# Altium schematic sheet 2.4Ghz Chip Board.SchDoc: 2.4Ghz Chip Board
size Letter
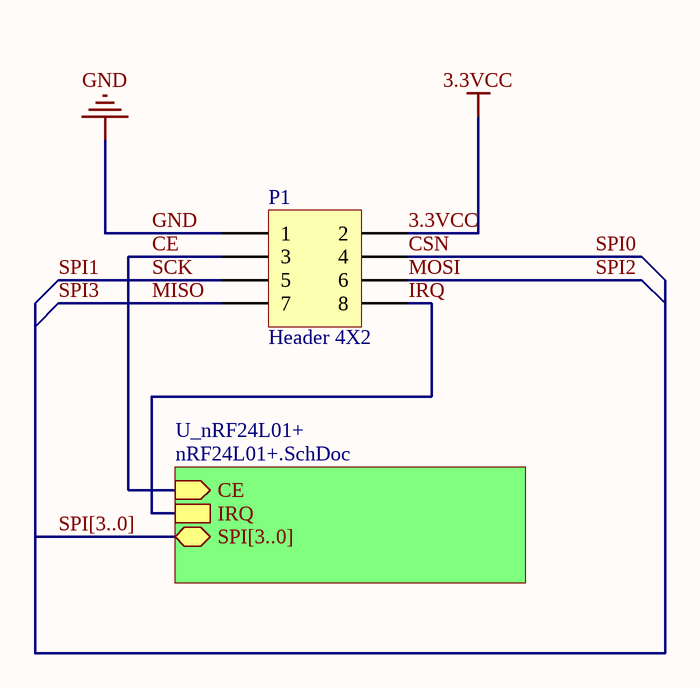
[diagram p0: 2.4Ghz Chip Board.SchDoc]

## Parts
P1  Header 4X2  [HDR2X4]

## Sub-sheets
U_nRF24L01+ = nRF24L01+.SchDoc: CE (in), IRQ, SPI[3..0] (bidir)

## Nets
3.3VCC: P1.2
GND: P1.1
CE: P1.3 ; sheet U_nRF24L01+/CE
CSN: P1.4  [also labelled SPI0]
IRQ: P1.8 ; sheet U_nRF24L01+/IRQ
MISO: P1.7  [also labelled SPI3]
MOSI: P1.6  [also labelled SPI2]
SCK: P1.5  [also labelled SPI1]

## Buses and harness runs
bus SPI[3..0] = sheet U_nRF24L01+/SPI[3..0]

## Notes on the sheet
- Title
- Size:
- Date:
- Letter
- Number:
- Time:
- Revision:
- Sheet
- of
- File:

## Library data of the parts
P1 = Header 4X2: Header, 4-Pin, Dual row; LatestRevisionDate: 17-Jul-2002; LatestRevisionNote: Re-released for DXP Platform.; Publisher: Altium Limited